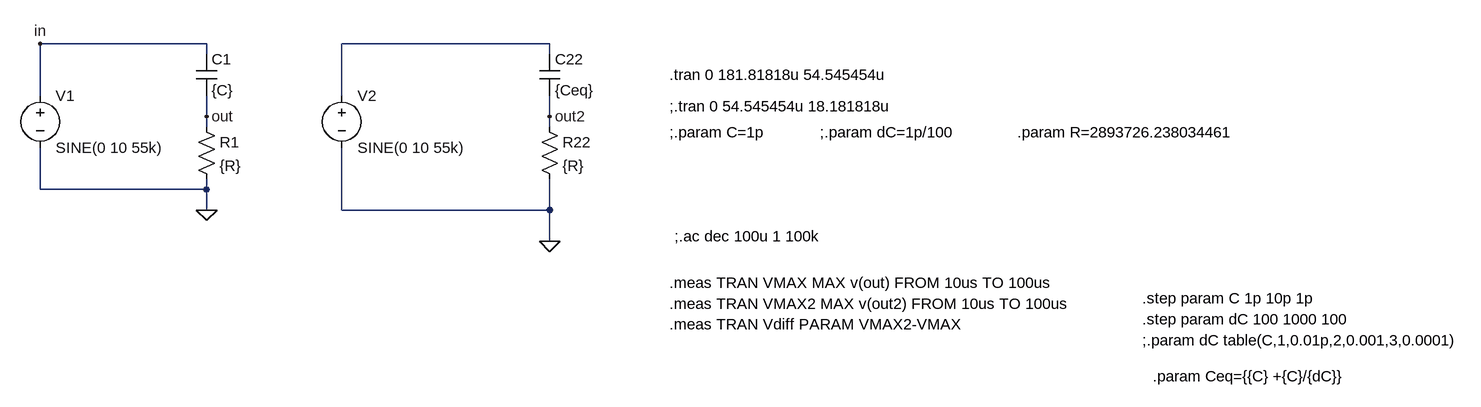
[diagram p0: schematic RC_Difference_LTSpice.asc]
RC_Difference_LTSpice.asc, the LTspice schematic file:
Version 4
SHEET 1 2260 680
WIRE 208 -16 -48 -16
WIRE 736 -16 416 -16
WIRE 208 0 208 -16
WIRE 736 0 736 -16
WIRE -48 64 -48 -16
WIRE 416 64 416 -16
WIRE 208 96 208 64
WIRE 736 96 736 64
WIRE 208 112 208 96
WIRE 736 112 736 96
WIRE -48 208 -48 144
WIRE 208 208 208 192
WIRE 208 208 -48 208
WIRE 208 240 208 208
WIRE 416 240 416 144
WIRE 736 240 736 192
WIRE 736 240 416 240
WIRE 736 288 736 240
FLAG 208 96 out
FLAG 208 240 0
FLAG -48 -16 in
FLAG 736 96 out2
FLAG 736 288 0
SYMBOL res 192 96 R0
SYMATTR InstName R1
SYMATTR Value {R}
SYMBOL cap 192 0 R0
SYMATTR InstName C1
SYMATTR Value {C}
SYMBOL voltage -48 48 R0
WINDOW 39 0 0 Left 0
SYMATTR InstName V1
SYMATTR Value SINE(0 10 55k)
SYMBOL res 720 96 R0
SYMATTR InstName R22
SYMATTR Value {R}
SYMBOL cap 720 0 R0
SYMATTR InstName C22
SYMATTR Value {Ceq}
SYMBOL voltage 416 48 R0
WINDOW 123 0 0 Left 0
WINDOW 39 0 0 Left 0
SYMATTR InstName V2
SYMATTR Value SINE(0 10 55k)
TEXT 928 280 Left 2 !;.ac dec 100u 1 100k
TEXT 920 80 Left 2 !;.tran 0 54.545454u 18.181818u
TEXT 920 120 Left 2 !;.param C=1p
TEXT 920 32 Left 2 !.tran 0 181.81818u 54.545454u
TEXT 920 352 Left 2 !.meas TRAN VMAX MAX v(out) FROM 10us TO 100us
TEXT 920 384 Left 2 !.meas TRAN VMAX2 MAX v(out2) FROM 10us TO 100us
TEXT 920 416 Left 2 !.meas TRAN Vdiff PARAM VMAX2-VMAX
TEXT 1648 376 Left 2 !.step param C 1p 10p 1p
TEXT 1152 120 Left 2 !;.param dC=1p/100
TEXT 1456 120 Left 2 !.param R=2893726.238034461
TEXT 1648 440 Left 2 !;.param dC table(C,1,0.01p,2,0.001,3,0.0001)
TEXT 1648 408 Left 2 !.step param dC 100 1000 100
TEXT 1664 496 Left 2 !.param Ceq={{C} +{C}/{dC}}

The netlist it stands for:
* RC_Difference_LTSpice.asc
R1 out 0 {R}
C1 in out {C}
V1 in 0 SINE(0 10 55k)
R22 out2 0 {R}
C22 N001 out2 {Ceq}
V2 N001 0 SINE(0 10 55k)
;.ac dec 100u 1 100k
;.tran 0 54.545454u 18.181818u
;.param C=1p
.tran 0 181.81818u 54.545454u
.meas TRAN VMAX MAX v(out) FROM 10us TO 100us
.meas TRAN VMAX2 MAX v(out2) FROM 10us TO 100us
.meas TRAN Vdiff PARAM VMAX2-VMAX
.step param C 1p 10p 1p
;.param dC=1p/100
.param R=2893726.238034461
;.param dC table(C,1,0.01p,2,0.001,3,0.0001)
.step param dC 100 1000 100
.param Ceq={{C} +{C}/{dC}}
.backanno
.end

* Results of the author's LTspice run, read from the files saved beside the schematic
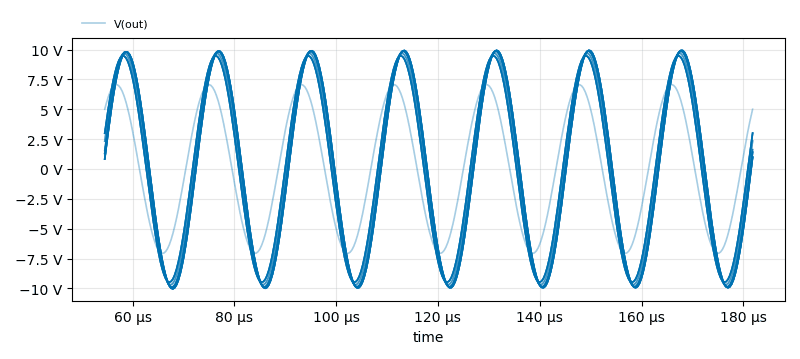
[diagram p1: Transient Analysis of RC_Difference_LTSpice.asc, plotted from the saved traces]
* Transient Analysis, 100 runs:
*   V(out) [run 1]: min -7.065 V, max 7.065 V, average 21.56 µV, rms 4.996 V, last 5 V
*   V(out) [run 2]: min -9.94 V, max 9.885 V, average -15.05 mV, rms 6.99 V, last 1.399 V
*   V(out) [run 3]: min -9.693 V, max 9.692 V, average -1.915 mV, rms 6.853 V, last 2.352 V
*   V(out) [run 4]: min -10.03 V, max 9.931 V, average -33.75 mV, rms 7.025 V, last 987.9 mV
*   V(out) [run 5]: min -9.94 V, max 9.885 V, average -15.05 mV, rms 6.99 V, last 1.399 V
*   V(out) [run 6]: min -9.693 V, max 9.692 V, average -1.915 mV, rms 6.853 V, last 2.352 V
*   V(out) [run 7]: min -10.03 V, max 9.931 V, average -33.75 mV, rms 7.025 V, last 987.9 mV
*   V(out) [run 8]: min -9.94 V, max 9.885 V, average -15.05 mV, rms 6.99 V, last 1.399 V
* From the log:
*   Measurement: vmax
*     step  MAX(v(out))  FROM  TO
*        1  7.06538  1e-005  0.0001
*        2  8.93606  1e-005  0.0001
*        3  9.47814  1e-005  0.0001
*        4  9.69225  1e-005  0.0001
*        5  9.79579  1e-005  0.0001
*        6  9.84798  1e-005  0.0001
*        7  9.8853  1e-005  0.0001
*        8  9.91147  1e-005  0.0001
*        9  9.92436  1e-005  0.0001
*       10  9.93117  1e-005  0.0001
*       11  7.06538  1e-005  0.0001
*       12  8.93606  1e-005  0.0001
*       13  9.47814  1e-005  0.0001
*       14  9.69225  1e-005  0.0001
*       15  9.79579  1e-005  0.0001
*       16  9.84798  1e-005  0.0001
*       17  9.8853  1e-005  0.0001
*       18  9.91147  1e-005  0.0001
*       19  9.92436  1e-005  0.0001
*       20  9.93117  1e-005  0.0001
*       21  7.06538  1e-005  0.0001
*       22  8.93606  1e-005  0.0001
*       23  9.47814  1e-005  0.0001
*       24  9.69225  1e-005  0.0001
*       25  9.79579  1e-005  0.0001
*       26  9.84798  1e-005  0.0001
*       27  9.8853  1e-005  0.0001
*       28  9.91147  1e-005  0.0001
*       29  9.92436  1e-005  0.0001
*       30  9.93117  1e-005  0.0001
*       31  7.06538  1e-005  0.0001
*       32  8.93606  1e-005  0.0001
*       33  9.47814  1e-005  0.0001
*       34  9.69225  1e-005  0.0001
*       35  9.79579  1e-005  0.0001
*       36  9.84798  1e-005  0.0001
*       37  9.8853  1e-005  0.0001
*       38  9.91147  1e-005  0.0001
*       39  9.92436  1e-005  0.0001
*       40  9.93117  1e-005  0.0001
*     ...
*   Measurement: vmax2
*     step  MAX(v(out2))  FROM  TO
*        1  7.10012  1e-005  0.0001
*        2  8.95346  1e-005  0.0001
*        3  9.48734  1e-005  0.0001
*        4  9.69769  1e-005  0.0001
*        5  9.79933  1e-005  0.0001
*        6  9.85114  1e-005  0.0001
*        7  9.88679  1e-005  0.0001
*        8  9.9128  1e-005  0.0001
*        9  9.92518  1e-005  0.0001
*       10  9.93162  1e-005  0.0001
*       11  7.08284  1e-005  0.0001
*       12  8.94476  1e-005  0.0001
*       13  9.48278  1e-005  0.0001
*       14  9.695  1e-005  0.0001
*       15  9.79758  1e-005  0.0001
*       16  9.84957  1e-005  0.0001
*       17  9.88605  1e-005  0.0001
*       18  9.91214  1e-005  0.0001
*       19  9.92478  1e-005  0.0001
*       20  9.9314  1e-005  0.0001
*       21  7.07704  1e-005  0.0001
*       22  8.94188  1e-005  0.0001
*       23  9.48124  1e-005  0.0001
*       24  9.69409  1e-005  0.0001
*       25  9.79699  1e-005  0.0001
*       26  9.84904  1e-005  0.0001
*       27  9.8858  1e-005  0.0001
*       28  9.91192  1e-005  0.0001
*       29  9.92464  1e-005  0.0001
*       30  9.93133  1e-005  0.0001
*       31  7.07413  1e-005  0.0001
*       32  8.94043  1e-005  0.0001
*       33  9.48047  1e-005  0.0001
*       34  9.69363  1e-005  0.0001
*       35  9.79669  1e-005  0.0001
*       36  9.84878  1e-005  0.0001
*       37  9.88568  1e-005  0.0001
*       38  9.91181  1e-005  0.0001
*       39  9.92457  1e-005  0.0001
*       40  9.93129  1e-005  0.0001
*     ...
*   Measurement: vdiff
*     step  vmax2-vmax
*        1  0.0347419
*        2  0.0174036
*        3  0.00920391
*        4  0.00544071
*        5  0.0035429
*        6  0.00315952
*        7  0.00149155
*        8  0.00133228
*        9  0.00082016
*       10  0.000442505
*       11  0.0174584
*       12  0.00870132
*       13  0.00464344
*       14  0.00274563
*       15  0.00178909
*       16  0.00159359
*       17  0.00075531
*       18  0.000674248
*       19  0.000415802
*       20  0.000226021
*       21  0.0116587
*       22  0.00581646
*       23  0.00310516
*       24  0.00183678
*       25  0.00119686
*       26  0.00106525
*       27  0.000505447
*       28  0.000451088
*       29  0.000278473
*       30  0.000152588
*       31  0.00875092
*       32  0.00436878
*       33  0.00233173
*       34  0.00137997
*       35  0.000898361
*       36  0.000800133
*       37  0.000380516
*       38  0.000339508
*       39  0.000208855
*       40  0.000114441
*     ...